# Altium schematic sheet POWER.SchDoc
size 420 x 297 mm; Organization: Altium Limited; Address1: L3, 12a Rodborough Rd; Address2: Frenchs Forest; Address3: NSW; Address4: Australia 2086
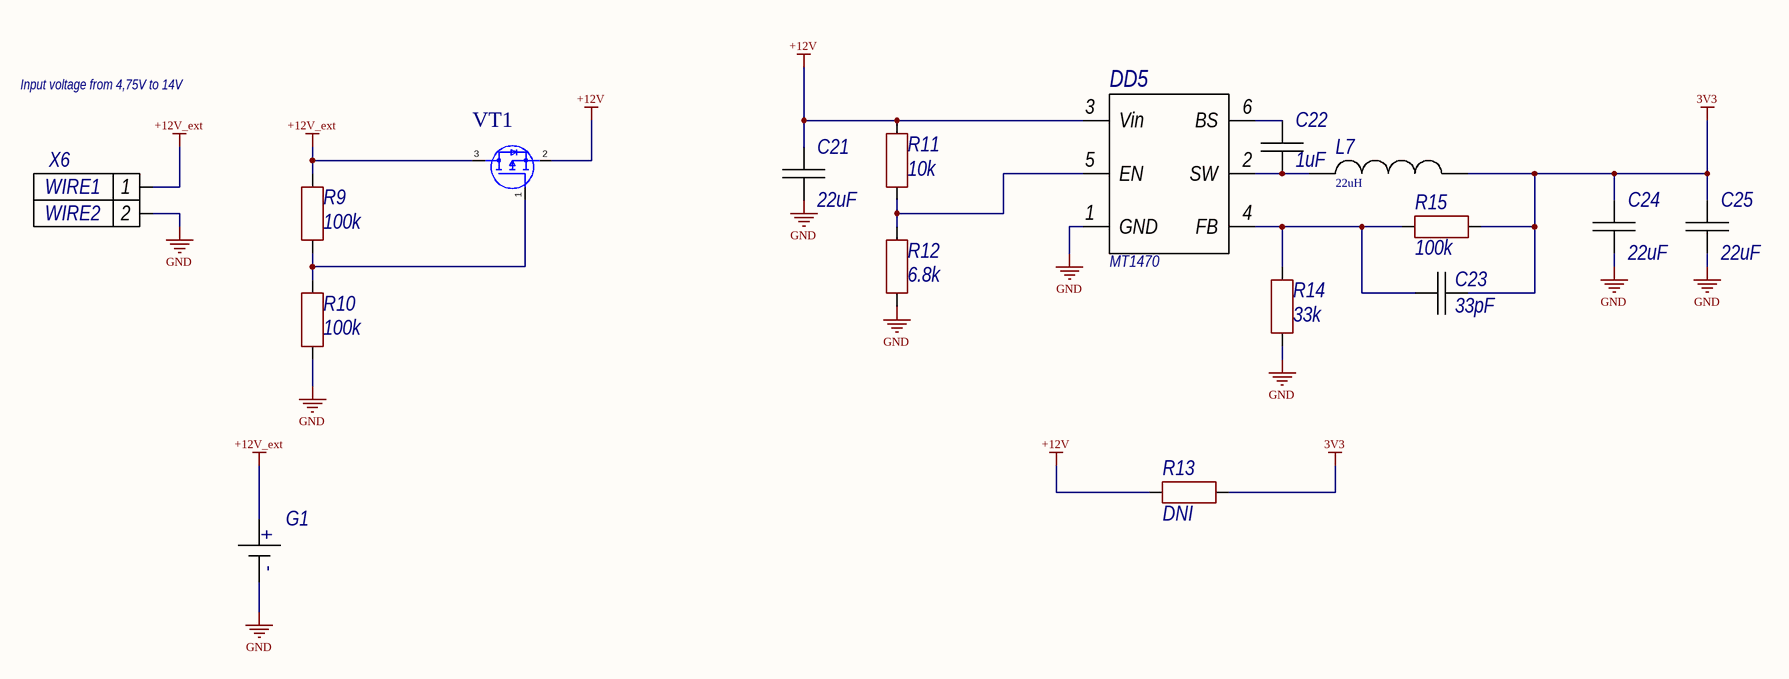
[diagram p0: POWER.SchDoc]

## Parts
C21  value 22uF  [CAPC0805N]  (hidden comment: CAPC0805)
C22  1uF  [CAPC0603N]
C23  33pF  [CAP0402]
C24  value 22uF  [CAPC0805N]  (hidden comment: CAPC0805)
C25  value 22uF  [CAPC0805N]  (hidden comment: CAPC0805)
DD5  MPN: MT1470  [SOT23-6]
G1  C70373  [BAT-SMD_CR2032-3V]  (value not drawn)
L7  22uH  [CAPC0805N]
R9  100k  [RESC0402(1005)_M]
R10  100k  [RESC0402(1005)_M]
R11  10k  [RESC0402(1005)_M]
R12  6.8k  [RESC0402(1005)_M]
R13  DNI  [RESC0603N]
R14  33k  [RESC0402(1005)_M]
R15  100k  [RESC0402(1005)_M]
VT1  AO3401A  [SOT-23]  (value not drawn)
X6  DG500-5.0-02P-14  [DG500-5.0-02P-14]  (value not drawn)

## Nets
3V3: C23.1 C24.2 C25.2 L7.2 R13.2 R15.2
+12V: C21.2 DD5.3(Vin) R11.1 R13.1 VT1.2(S)
+12V_ext: G1.1(+) R9.1 VT1.3(D) X6.1
GND: C21.1 C24.1 C25.1 DD5.1(GND) G1.2(-) R10.2 R12.2 R14.2 X6.2
NetC22_1: C22.1 DD5.2(SW) L7.1
NetC22_2: C22.2 DD5.6(BS)
NetC23_2: C23.2 DD5.4(FB) R14.1 R15.1
NetDD5_5: DD5.5(EN) R11.2 R12.1
NetR9_2: R9.2 R10.1 VT1.1(G)

## Notes on the sheet
- Input voltage from 4,75V to 14V
- Подп. и дата
- Инв.№ дубл.
- Взам.инв.№
- Подп.и дата
- Инв.№ подл.
- Изм.
- Лист
- № докум.
- Подп.
- Дата
- Формат  A3

## Library data of the parts
C21 = CAPC0805: MntType: SMD; Voltage: 25V; MSL: MSL 1; Package: =Footprint; RoHS: Comply; PartType: CHIP CERAMIC CAPACITOR; Pins: 2; BOMDescription: =MntType+' '+PartType+' '+Package+' '+Value+' '+Tolerance+' '+Voltage+' '+TempCoeff+' '+MPN; CFootprint: =Footprint; Part Number: CAPC0805; ClassName: Capacitor; ComponentLink1Description: Datasheet
C22 = CAPC: MntType: SMD; MSL: MSL 1; Package: =Footprint; RoHS: Comply; PartType: CHIP CERAMIC CAPACITOR; Pins: 2; BOMDescription: =MntType+' '+PartType+' '+Package+' '+Value+' '+Tolerance+' '+Voltage+' '+TempCoeff+' '+MPN; CFootprint: =Footprint; Value: 1uF; Part Number: CAPC; ClassName: Capacitor; ComponentLink1Description: Datasheet
C23 = CAP0402: MntType: SMD; BOMDescription: SMD CHIP CERAMIC CAPACITOR C_0402 33pF; MSL: MSL 1; Package: C_0402; RoHS: Comply; PartType: CHIP CERAMIC CAPACITOR; Pins: 2; CFootprint: =Footprint; Value: 33pF; Part Number: CAP0402; ClassName: Capacitor; ComponentLink1Description: Datasheet
C24 C25 = CAPC0805: MntType: SMD; Voltage: 25V; Rule: UNIONINDEX=0|RULEKIND=PolygonConnect|NETSCOPE=AnyNet|LAYERKIND=SameLayer|NAME=Schematic Polygon Connect Style|CONNECTSTYLE=Relief|RELIEFCONDUCTORWIDTH=15.748mil|RELIEFENTRIES=4|POLYGONRELIEFANGLE=90 Angle|AIRGAPWIDTH=10mil|UNIT=Metric; MSL: MSL 1; Package: =Footprint; RoHS: Comply; PartType: CHIP CERAMIC CAPACITOR; Pins: 2; BOMDescription: =MntType+' '+PartType+' '+Package+' '+Value+' '+Tolerance+' '+Voltage+' '+TempCoeff+' '+MPN; CFootprint: =Footprint; Part Number: CAPC0805; ClassName: Capacitor; ComponentLink1Description: Datasheet
DD5 = MT1470: Manufacturer: XI'AN Aerosemi Tech; MntType: SMD; Part Number: MT1470; MSL: MSL 1; Package: SOT23-6; RoHS: Comply; PartType: Buck converter; Pins: 6; BOMDescription: MT1470; CFootprint: =Footprint; ClassName: Buck; ComponentLink1Description: Datasheet; ComponentLink1URL: https://datasheet.lcsc.com/lcsc/2109171430_XI-AN-Aerosemi-Tech-MT1470_C181781.pdf
G1 = C70373: MntType: SMD; Part Number: C70373; MPN: C70373; MSL: MSL 1; RoHS: Comply; PartType: Battery; Pins: 2; BOMDescription: C70373; CFootprint: =Footprint; ClassName: Battery; ComponentLink1Description: Datasheet; ComponentLink1URL: https://datasheet.lcsc.com/lcsc/1810231513_Q&J-C70373_C70373.pdf
L7 = MGFL2012F220MT-LF: Manufacturer: microgate; MntType: SMD; MPN: MGFL2012F220MT-LF; MSL: MSL 1; Package: =Footprint; RoHS: Comply; PartType: INDUCTOR; Pins: 2; BOMDescription: MGFL2012F220MT-LF; CFootprint: =Footprint; Value: 22uH; Part Number: MGFL2012F220MT-LF; ClassName: Inductor; ComponentLink1Description: Datasheet; ComponentLink1URL: https://datasheet.lcsc.com/lcsc/2002201432_microgate-MGFL2012F220MT-LF_C486334.pdf
R9-R12 R14 R15 = RES0402: MntType: SMD; MSL: MSL 1; Package: =Footprint; RoHS: Comply; PartType: CHIP RESISTOR; Pins: 2; BOMDescription: =MntType+' '+PartType+' '+Package+' '+Value+' '+Tolerance+' '+Voltage+' '+TempCoeff+' '+MPN; CFootprint: =Footprint; Part Number: RES0402; ClassName: Resistor; ComponentLink1Description: Datasheet
  R9 R10 R15: Value: 100k
  R11: Value: 10k
  R12: Value: 6.8k
  R14: Value: 33k
R13 = RES: MntType: SMD; MSL: MSL 1; Package: =Footprint; RoHS: Comply; PartType: CHIP RESISTOR; Pins: 2; BOMDescription: =MntType+' '+PartType+' '+Package+' '+Value+' '+Tolerance+' '+Voltage+' '+TempCoeff+' '+MPN; CFootprint: =Footprint; Value: DNI; Part Number: RES; ClassName: Resistor; ComponentLink1Description: Datasheet
VT1 = AO3401A: MntType: SMD; Part Number: AO3401A; MPN: AO3401A; MSL: MSL 1; Package: SOT-23; RoHS: Comply; PartType: P-MOSFET; Pins: 3; BOMDescription: AO3401A; CFootprint: =Footprint; ClassName: MosFET; ComponentLink1Description: Datasheet; ComponentLink1URL: https://datasheet.lcsc.com/lcsc/2007171935_HUASHUO-AO3401A_C700954.pdf
X6 = DG500-5.0-02P-14: MntType: DIP; System: Connector; Rule: UNIONINDEX=0|RULEKIND=PolygonConnect|NETSCOPE=AnyNet|LAYERKIND=SameLayer|NAME=Schematic Polygon Connect Style|CONNECTSTYLE=Relief|RELIEFCONDUCTORWIDTH=19.685mil|RELIEFENTRIES=4|POLYGONRELIEFANGLE=90 Angle|AIRGAPWIDTH=10mil|UNIT=Metric; Wire2: WIRE2; Wire1: WIRE1; Part Number: DG500-5.0-02P-14; Value: DG500-5.0-02P-14; MPN: DG500-5.0-02P-14; MSL: MSL 1; RoHS: Comply; PartType: CONNECTOR; Pins: 2; BOMDescription: =MntType+' '+PartType+' '+Package+' '+Value+' '+Tolerance+' '+Voltage+' '+TempCoeff+' '+MPN; CFootprint: =Footprint; ClassName: Connector; ComponentLink1Description: Datasheet